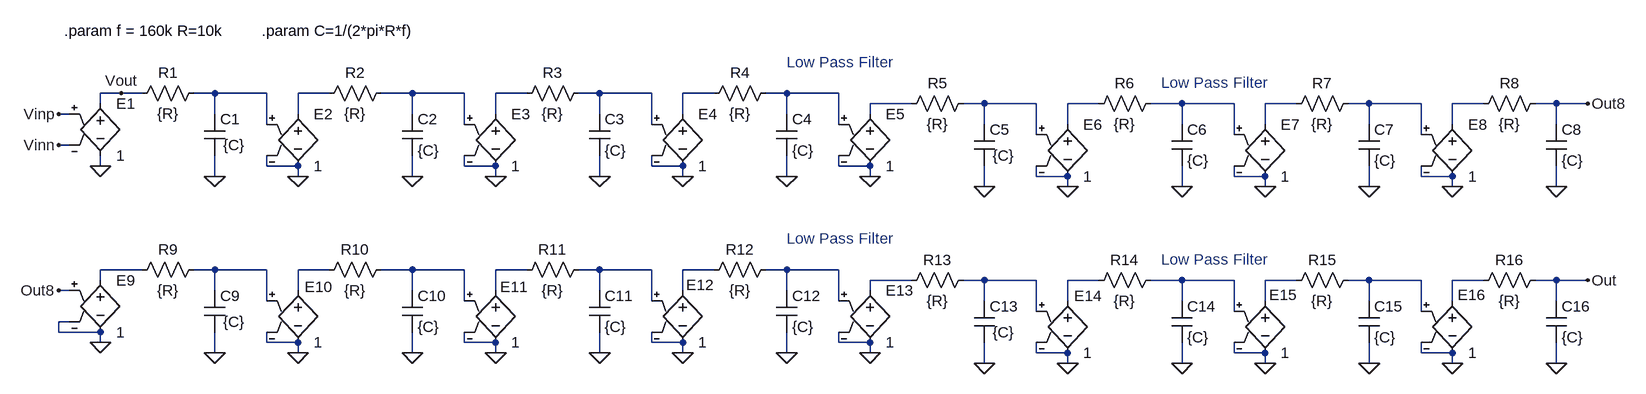
[diagram p0: schematic DiffLPF.asc]
DiffLPF.asc, the LTspice schematic file:
Version 4
SHEET 1 2068 680
WIRE -272 80 -304 80
WIRE -240 80 -272 80
WIRE -128 80 -160 80
WIRE -48 80 -128 80
WIRE 48 80 0 80
WIRE 176 80 128 80
WIRE 256 80 176 80
WIRE 352 80 304 80
WIRE 464 80 432 80
WIRE 544 80 464 80
WIRE 640 80 592 80
WIRE 752 80 720 80
WIRE 832 80 752 80
WIRE -304 96 -304 80
WIRE 944 96 880 96
WIRE 1056 96 1024 96
WIRE 1136 96 1056 96
WIRE 1232 96 1184 96
WIRE 1360 96 1312 96
WIRE 1440 96 1360 96
WIRE 1536 96 1488 96
WIRE 1648 96 1616 96
WIRE 1728 96 1648 96
WIRE 1824 96 1776 96
WIRE 1936 96 1904 96
WIRE 1984 96 1936 96
WIRE -352 112 -368 112
WIRE -128 112 -128 80
WIRE 0 112 0 80
WIRE 176 112 176 80
WIRE 304 112 304 80
WIRE 464 112 464 80
WIRE 592 112 592 80
WIRE 752 112 752 80
WIRE 880 112 880 96
WIRE -48 128 -48 80
WIRE 256 128 256 80
WIRE 544 128 544 80
WIRE 832 128 832 80
WIRE 1056 128 1056 96
WIRE 1184 128 1184 96
WIRE 1360 128 1360 96
WIRE 1488 128 1488 96
WIRE 1648 128 1648 96
WIRE 1776 128 1776 96
WIRE 1936 128 1936 96
WIRE 1136 144 1136 96
WIRE 1440 144 1440 96
WIRE 1728 144 1728 96
WIRE -352 160 -368 160
WIRE -304 192 -304 176
WIRE -48 192 -48 176
WIRE 0 192 -48 192
WIRE 256 192 256 176
WIRE 304 192 256 192
WIRE 544 192 544 176
WIRE 592 192 544 192
WIRE 832 192 832 176
WIRE 880 192 832 192
WIRE -128 208 -128 176
WIRE 0 208 0 192
WIRE 176 208 176 176
WIRE 304 208 304 192
WIRE 464 208 464 176
WIRE 592 208 592 192
WIRE 752 208 752 176
WIRE 880 208 880 192
WIRE 1136 208 1136 192
WIRE 1184 208 1136 208
WIRE 1440 208 1440 192
WIRE 1488 208 1440 208
WIRE 1728 208 1728 192
WIRE 1776 208 1728 208
WIRE 1056 224 1056 192
WIRE 1184 224 1184 208
WIRE 1360 224 1360 192
WIRE 1488 224 1488 208
WIRE 1648 224 1648 192
WIRE 1776 224 1776 208
WIRE 1936 224 1936 192
WIRE -240 352 -304 352
WIRE -128 352 -160 352
WIRE -48 352 -128 352
WIRE 48 352 0 352
WIRE 176 352 128 352
WIRE 256 352 176 352
WIRE 352 352 304 352
WIRE 464 352 432 352
WIRE 544 352 464 352
WIRE 640 352 592 352
WIRE 752 352 720 352
WIRE 832 352 752 352
WIRE -304 368 -304 352
WIRE 944 368 880 368
WIRE 1056 368 1024 368
WIRE 1136 368 1056 368
WIRE 1232 368 1184 368
WIRE 1360 368 1312 368
WIRE 1440 368 1360 368
WIRE 1536 368 1488 368
WIRE 1648 368 1616 368
WIRE 1728 368 1648 368
WIRE 1824 368 1776 368
WIRE 1936 368 1904 368
WIRE 1984 368 1936 368
WIRE -352 384 -368 384
WIRE -128 384 -128 352
WIRE 0 384 0 352
WIRE 176 384 176 352
WIRE 304 384 304 352
WIRE 464 384 464 352
WIRE 592 384 592 352
WIRE 752 384 752 352
WIRE 880 384 880 368
WIRE -48 400 -48 352
WIRE 256 400 256 352
WIRE 544 400 544 352
WIRE 832 400 832 352
WIRE 1056 400 1056 368
WIRE 1184 400 1184 368
WIRE 1360 400 1360 368
WIRE 1488 400 1488 368
WIRE 1648 400 1648 368
WIRE 1776 400 1776 368
WIRE 1936 400 1936 368
WIRE 1136 416 1136 368
WIRE 1440 416 1440 368
WIRE 1728 416 1728 368
WIRE -352 432 -368 432
WIRE -368 448 -368 432
WIRE -304 448 -368 448
WIRE -304 464 -304 448
WIRE -48 464 -48 448
WIRE 0 464 -48 464
WIRE 256 464 256 448
WIRE 304 464 256 464
WIRE 544 464 544 448
WIRE 592 464 544 464
WIRE 832 464 832 448
WIRE 880 464 832 464
WIRE -128 480 -128 448
WIRE 0 480 0 464
WIRE 176 480 176 448
WIRE 304 480 304 464
WIRE 464 480 464 448
WIRE 592 480 592 464
WIRE 752 480 752 448
WIRE 880 480 880 464
WIRE 1136 480 1136 464
WIRE 1184 480 1136 480
WIRE 1440 480 1440 464
WIRE 1488 480 1440 480
WIRE 1728 480 1728 464
WIRE 1776 480 1728 480
WIRE 1056 496 1056 464
WIRE 1184 496 1184 480
WIRE 1360 496 1360 464
WIRE 1488 496 1488 480
WIRE 1648 496 1648 464
WIRE 1776 496 1776 480
WIRE 1936 496 1936 464
FLAG -304 192 0
FLAG 0 208 0
FLAG 304 208 0
FLAG -128 208 0
FLAG 176 208 0
FLAG 464 208 0
FLAG 1984 96 Out8
FLAG -272 80 Vout
FLAG -368 160 Vinn
FLAG -368 112 Vinp
FLAG 592 208 0
FLAG 752 208 0
FLAG 880 208 0
FLAG 1184 224 0
FLAG 1488 224 0
FLAG 1056 224 0
FLAG 1360 224 0
FLAG 1648 224 0
FLAG 1776 224 0
FLAG 1936 224 0
FLAG -304 464 0
FLAG 0 480 0
FLAG 304 480 0
FLAG -128 480 0
FLAG 176 480 0
FLAG 464 480 0
FLAG 1984 368 Out
FLAG 592 480 0
FLAG 752 480 0
FLAG 880 480 0
FLAG 1184 496 0
FLAG 1488 496 0
FLAG 1056 496 0
FLAG 1360 496 0
FLAG 1648 496 0
FLAG 1776 496 0
FLAG 1936 496 0
FLAG -368 384 Out8
SYMBOL res -256 96 R270
WINDOW 0 32 56 VTop 0
WINDOW 3 0 56 VBottom 0
SYMATTR InstName R1
SYMATTR Value {R}
SYMBOL e 0 96 R0
SYMATTR InstName E2
SYMATTR Value 1
SYMBOL e 304 96 R0
SYMATTR InstName E3
SYMATTR Value 1
SYMBOL cap -144 112 R0
WINDOW 3 29 48 Left 0
SYMATTR Value {C}
SYMATTR InstName C1
SYMBOL cap 160 112 R0
SYMATTR InstName C2
SYMATTR Value {C}
SYMBOL cap 448 112 R0
SYMATTR InstName C3
SYMATTR Value {C}
SYMBOL res 32 96 R270
WINDOW 0 32 56 VTop 0
WINDOW 3 0 56 VBottom 0
SYMATTR InstName R2
SYMATTR Value {R}
SYMBOL res 336 96 R270
WINDOW 0 32 56 VTop 0
WINDOW 3 0 56 VBottom 0
SYMATTR InstName R3
SYMATTR Value {R}
SYMBOL e -304 80 R0
SYMATTR InstName E1
SYMATTR Value 1
SYMBOL e 592 96 R0
SYMATTR InstName E4
SYMATTR Value 1
SYMBOL cap 736 112 R0
SYMATTR InstName C4
SYMATTR Value {C}
SYMBOL res 624 96 R270
WINDOW 0 32 56 VTop 0
WINDOW 3 0 56 VBottom 0
SYMATTR InstName R4
SYMATTR Value {R}
SYMBOL res 928 112 R270
WINDOW 0 32 56 VTop 0
WINDOW 3 0 56 VBottom 0
SYMATTR InstName R5
SYMATTR Value {R}
SYMBOL e 1184 112 R0
SYMATTR InstName E6
SYMATTR Value 1
SYMBOL e 1488 112 R0
SYMATTR InstName E7
SYMATTR Value 1
SYMBOL cap 1040 128 R0
WINDOW 3 29 48 Left 0
SYMATTR Value {C}
SYMATTR InstName C5
SYMBOL cap 1344 128 R0
SYMATTR InstName C6
SYMATTR Value {C}
SYMBOL cap 1632 128 R0
SYMATTR InstName C7
SYMATTR Value {C}
SYMBOL res 1216 112 R270
WINDOW 0 32 56 VTop 0
WINDOW 3 0 56 VBottom 0
SYMATTR InstName R6
SYMATTR Value {R}
SYMBOL res 1520 112 R270
WINDOW 0 32 56 VTop 0
WINDOW 3 0 56 VBottom 0
SYMATTR InstName R7
SYMATTR Value {R}
SYMBOL e 880 96 R0
SYMATTR InstName E5
SYMATTR Value 1
SYMBOL e 1776 112 R0
SYMATTR InstName E8
SYMATTR Value 1
SYMBOL cap 1920 128 R0
SYMATTR InstName C8
SYMATTR Value {C}
SYMBOL res 1808 112 R270
WINDOW 0 32 56 VTop 0
WINDOW 3 0 56 VBottom 0
SYMATTR InstName R8
SYMATTR Value {R}
SYMBOL res -256 368 R270
WINDOW 0 32 56 VTop 0
WINDOW 3 0 56 VBottom 0
SYMATTR InstName R9
SYMATTR Value {R}
SYMBOL e 0 368 R0
WINDOW 0 10 10 Left 0
SYMATTR InstName E10
SYMATTR Value 1
SYMBOL e 304 368 R0
WINDOW 0 7 10 Left 0
SYMATTR InstName E11
SYMATTR Value 1
SYMBOL cap -144 384 R0
WINDOW 3 29 48 Left 0
SYMATTR Value {C}
SYMATTR InstName C9
SYMBOL cap 160 384 R0
SYMATTR InstName C10
SYMATTR Value {C}
SYMBOL cap 448 384 R0
SYMATTR InstName C11
SYMATTR Value {C}
SYMBOL res 32 368 R270
WINDOW 0 32 56 VTop 0
WINDOW 3 0 56 VBottom 0
SYMATTR InstName R10
SYMATTR Value {R}
SYMBOL res 336 368 R270
WINDOW 0 32 56 VTop 0
WINDOW 3 0 56 VBottom 0
SYMATTR InstName R11
SYMATTR Value {R}
SYMBOL e -304 352 R0
SYMATTR InstName E9
SYMATTR Value 1
SYMBOL e 592 368 R0
WINDOW 0 5 7 Left 0
SYMATTR InstName E12
SYMATTR Value 1
SYMBOL cap 736 384 R0
SYMATTR InstName C12
SYMATTR Value {C}
SYMBOL res 624 368 R270
WINDOW 0 32 56 VTop 0
WINDOW 3 0 56 VBottom 0
SYMATTR InstName R12
SYMATTR Value {R}
SYMBOL res 928 384 R270
WINDOW 0 32 56 VTop 0
WINDOW 3 0 56 VBottom 0
SYMATTR InstName R13
SYMATTR Value {R}
SYMBOL e 1184 384 R0
WINDOW 0 10 8 Left 0
SYMATTR InstName E14
SYMATTR Value 1
SYMBOL e 1488 384 R0
WINDOW 0 6 7 Left 0
SYMATTR InstName E15
SYMATTR Value 1
SYMBOL cap 1040 400 R0
WINDOW 3 29 48 Left 0
SYMATTR Value {C}
SYMATTR InstName C13
SYMBOL cap 1344 400 R0
SYMATTR InstName C14
SYMATTR Value {C}
SYMBOL cap 1632 400 R0
SYMATTR InstName C15
SYMATTR Value {C}
SYMBOL res 1216 384 R270
WINDOW 0 32 56 VTop 0
WINDOW 3 0 56 VBottom 0
SYMATTR InstName R14
SYMATTR Value {R}
SYMBOL res 1520 384 R270
WINDOW 0 32 56 VTop 0
WINDOW 3 0 56 VBottom 0
SYMATTR InstName R15
SYMATTR Value {R}
SYMBOL e 880 368 R0
SYMATTR InstName E13
SYMATTR Value 1
SYMBOL e 1776 384 R0
WINDOW 0 8 7 Left 0
SYMATTR InstName E16
SYMATTR Value 1
SYMBOL cap 1920 400 R0
SYMATTR InstName C16
SYMATTR Value {C}
SYMBOL res 1808 384 R270
WINDOW 0 32 56 VTop 0
WINDOW 3 0 56 VBottom 0
SYMATTR InstName R16
SYMATTR Value {R}
TEXT 752 32 Left 0 ;Low Pass Filter
TEXT -360 -16 Left 0 !.param f = 160k R=10k
TEXT -56 -16 Left 0 !.param C=1/(2*pi*R*f)
TEXT 1328 64 Left 0 ;Low Pass Filter
TEXT 752 304 Left 0 ;Low Pass Filter
TEXT 1328 336 Left 0 ;Low Pass Filter

The netlist it stands for:
* DiffLPF.asc
R1 Vout N001 {R}
E2 N002 0 N001 0 1
E3 N004 0 N003 0 1
C1 N001 0 {C}
C2 N003 0 {C}
C3 N005 0 {C}
R2 N002 N003 {R}
R3 N004 N005 {R}
E1 Vout 0 Vinp Vinn 1
E4 N006 0 N005 0 1
C4 N007 0 {C}
R4 N006 N007 {R}
R5 N008 N009 {R}
E6 N010 0 N009 0 1
E7 N012 0 N011 0 1
C5 N009 0 {C}
C6 N011 0 {C}
C7 N013 0 {C}
R6 N010 N011 {R}
R7 N012 N013 {R}
E5 N008 0 N007 0 1
E8 N014 0 N013 0 1
C8 Out8 0 {C}
R8 N014 Out8 {R}
R9 N015 N016 {R}
E10 N017 0 N016 0 1
E11 N019 0 N018 0 1
C9 N016 0 {C}
C10 N018 0 {C}
C11 N020 0 {C}
R10 N017 N018 {R}
R11 N019 N020 {R}
E9 N015 0 Out8 0 1
E12 N021 0 N020 0 1
C12 N022 0 {C}
R12 N021 N022 {R}
R13 N023 N024 {R}
E14 N025 0 N024 0 1
E15 N027 0 N026 0 1
C13 N024 0 {C}
C14 N026 0 {C}
C15 N028 0 {C}
R14 N025 N026 {R}
R15 N027 N028 {R}
E13 N023 0 N022 0 1
E16 N029 0 N028 0 1
C16 Out 0 {C}
R16 N029 Out {R}
* Low Pass Filter
.param f = 160k R=10k
.param C=1/(2*pi*R*f)
* Low Pass Filter
* Low Pass Filter
* Low Pass Filter
.backanno
.end